# EAGLE schematic Jetsonboardbackup (EAGLE 9.4.2)
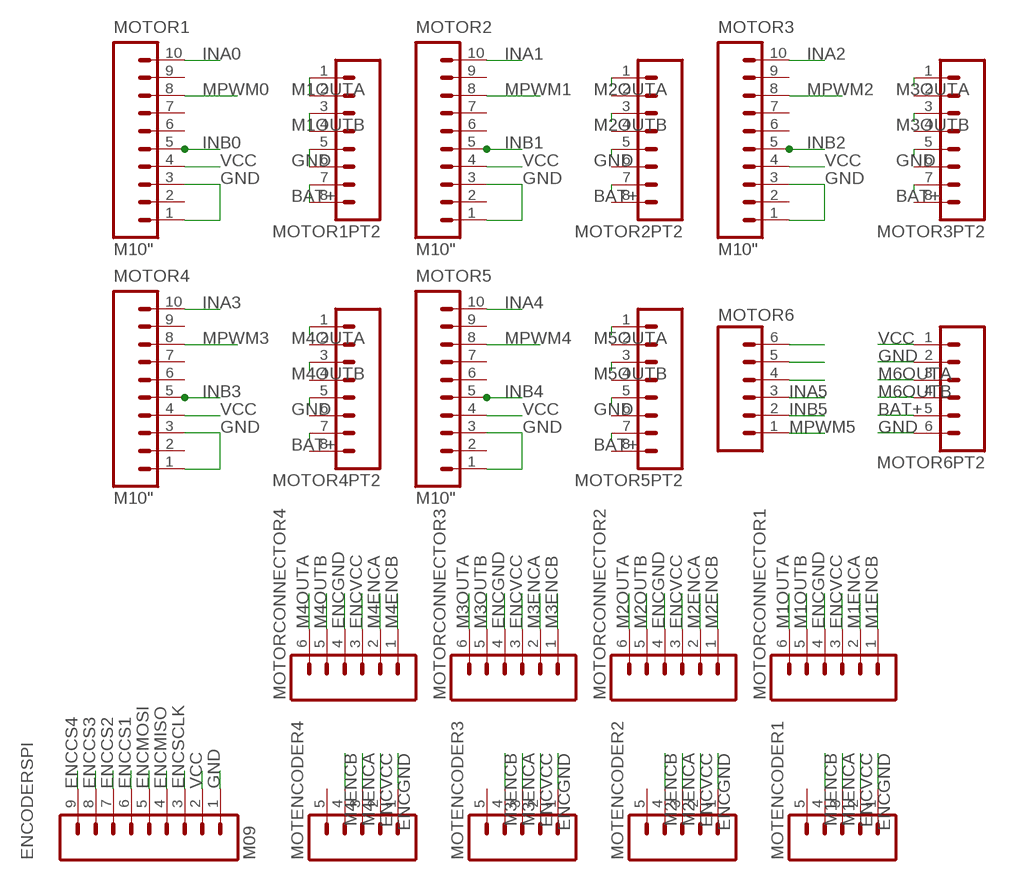
[diagram p0: schematic, sheet 1, part 1 of 2]
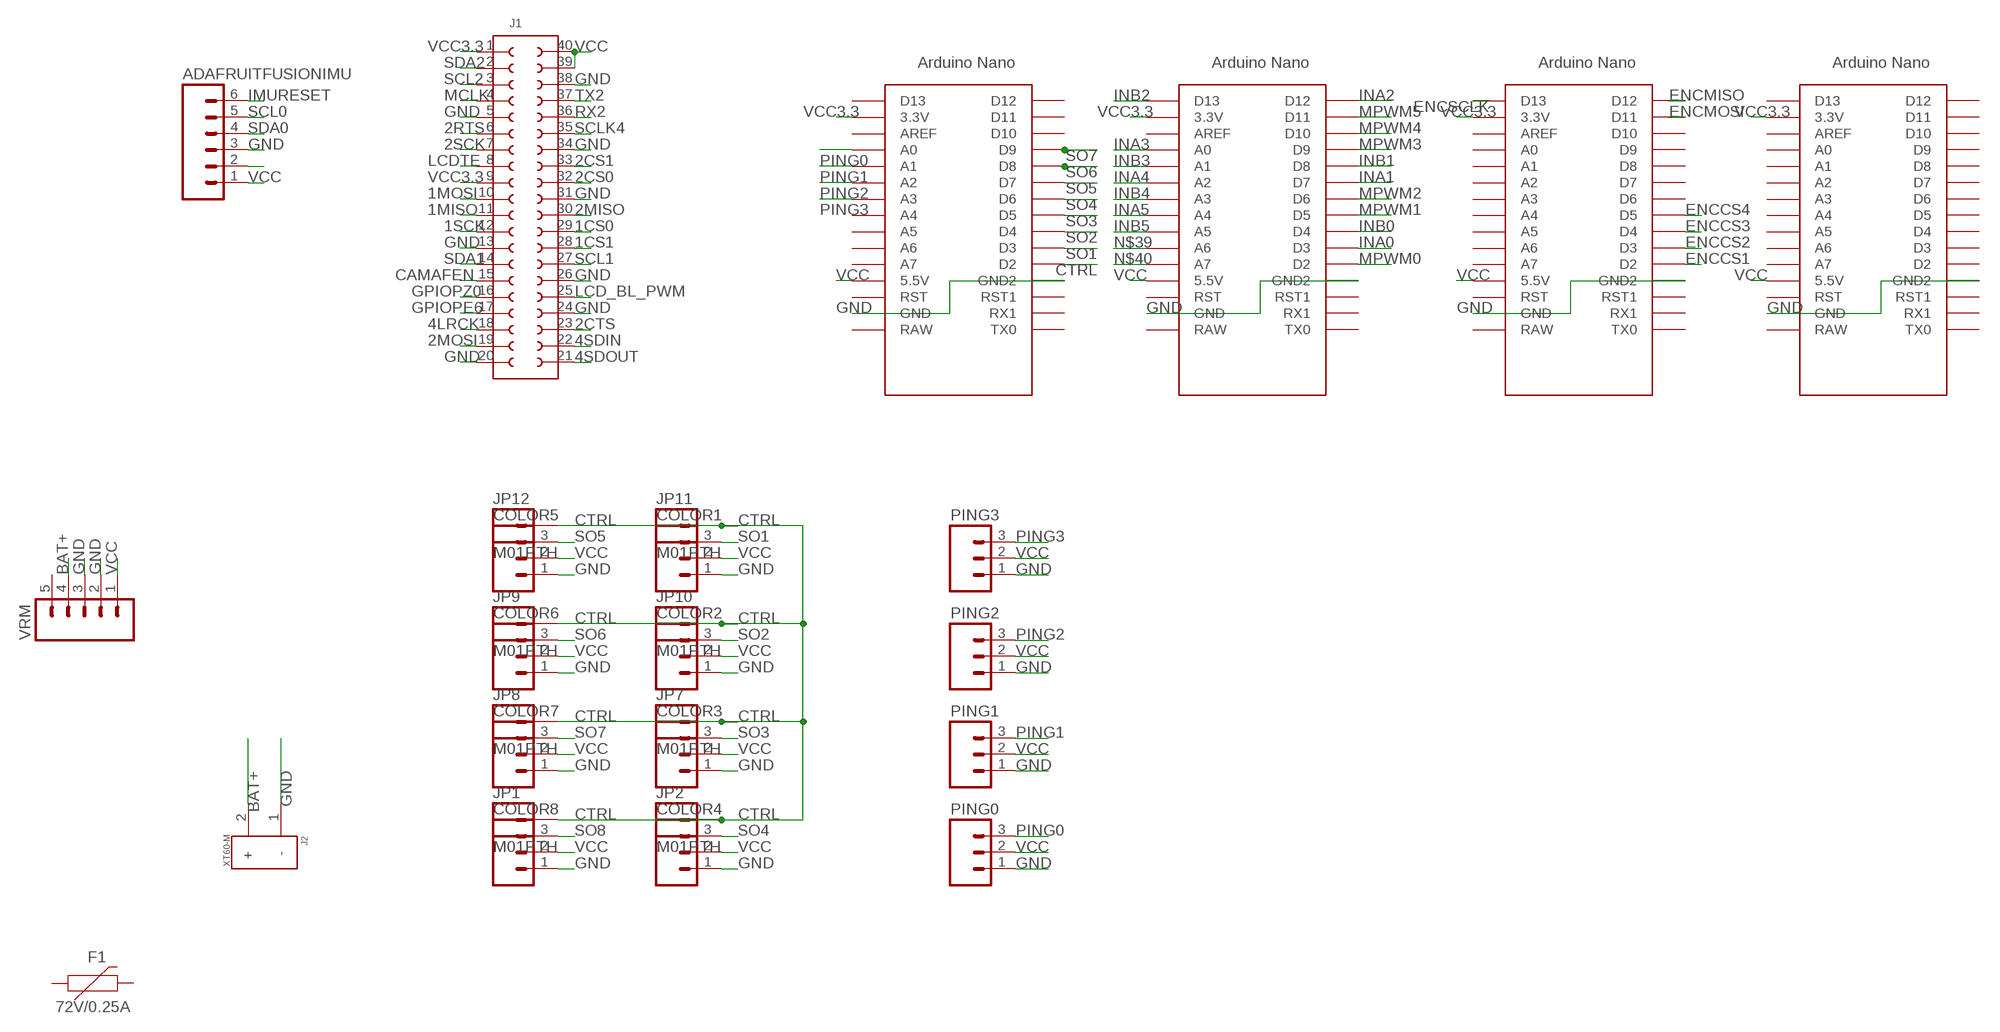
[diagram p1: schematic, sheet 1, part 2 of 2]

## Parts
ADAFRUITFUSIONIMU  M06SIP  [1X06]
COLOR1  M03PTH  [1X03]
COLOR2  M03PTH  [1X03]
COLOR3  M03PTH  [1X03]
COLOR4  M03PTH  [1X03]
COLOR5  M03PTH  [1X03]
COLOR6  M03PTH  [1X03]
COLOR7  M03PTH  [1X03]
COLOR8  M03PTH  [1X03]
ENCODERSPI  M09  [1X09]
F1  72V/0.25A  PPTC_PTH  [PTH]
J1  61304021021  [61304021021]
J2  XT60-M  [AMASS_XT60-M]
JP1  M01PTH  [1X01]
JP2  M01PTH  [1X01]
JP7  M01PTH  [1X01]
JP8  M01PTH  [1X01]
JP9  M01PTH  [1X01]
JP10  M01PTH  [1X01]
JP11  M01PTH  [1X01]
JP12  M01PTH  [1X01]
MOTENCODER1  M05PTH  [1X05]
MOTENCODER2  M05PTH  [1X05]
MOTENCODER3  M05PTH  [1X05]
MOTENCODER4  M05PTH  [1X05]
MOTOR1  M10"  [1X10]
MOTOR1PT2  M08  [1X08]
MOTOR2  M10"  [1X10]
MOTOR2PT2  M08  [1X08]
MOTOR3  M10"  [1X10]
MOTOR3PT2  M08  [1X08]
MOTOR4  M10"  [1X10]
MOTOR4PT2  M08  [1X08]
MOTOR5  M10"  [1X10]
MOTOR5PT2  M08  [1X08]
MOTOR6  M06SIP  [1X06]
MOTOR6PT2  M06SIP  [1X06]
MOTORCONNECTOR1  M06LONGPADS  [1X06_LONGPADS]
MOTORCONNECTOR2  M06LONGPADS  [1X06_LONGPADS]
MOTORCONNECTOR3  M06LONGPADS  [1X06_LONGPADS]
MOTORCONNECTOR4  M06LONGPADS  [1X06_LONGPADS]
PING0  M03PTH  [1X03]
PING1  M03PTH  [1X03]
PING2  M03PTH  [1X03]
PING3  M03PTH  [1X03]
U$1  NANO  [NANO]
U$2  NANO  [NANO]
U$3  NANO  [NANO]
U$6  NANO  [NANO]
VRM  M05PTH  [1X05]

## Nets
1CS0: J1.29
1CS1: J1.28
1MISO: J1.11
1MOSI: J1.10
1SCK: J1.12
2CS0: J1.32
2CS1: J1.33
2CTS: J1.23
2MISO: J1.30
2MOSI: J1.19
2RTS: J1.6
2SCK: J1.7
4LRCK: J1.18
4SDIN: J1.22
4SDOUT: J1.21
BAT+: J2.2(+) MOTOR1PT2.7 MOTOR1PT2.8 MOTOR2PT2.8 MOTOR3PT2.8 MOTOR4PT2.8 MOTOR5PT2.8 MOTOR6PT2.5 VRM.4
CAMAFEN: J1.15
CTRL: JP1.1 JP2.1 JP7.1 JP8.1 JP9.1 JP10.1 JP11.1 JP12.1 U$2.D2
ENCCS1: ENCODERSPI.6 U$1.D2
ENCCS2: ENCODERSPI.7 U$1.D3
ENCCS3: ENCODERSPI.8 U$1.D4
ENCCS4: ENCODERSPI.9 U$1.D5
ENCGND: MOTENCODER1.1 MOTENCODER2.1 MOTENCODER3.1 MOTENCODER4.1 MOTORCONNECTOR1.4 MOTORCONNECTOR2.4 MOTORCONNECTOR3.4 MOTORCONNECTOR4.4
ENCMISO: ENCODERSPI.4 U$1.D12
ENCMOSI: ENCODERSPI.5 U$1.D11
ENCSCLK: ENCODERSPI.3 U$1.D13
ENCVCC: MOTENCODER1.2 MOTENCODER2.2 MOTENCODER3.2 MOTENCODER4.2 MOTORCONNECTOR1.3 MOTORCONNECTOR2.3 MOTORCONNECTOR3.3 MOTORCONNECTOR4.3
GND: ADAFRUITFUSIONIMU.3 COLOR1.1 COLOR2.1 COLOR3.1 COLOR4.1 COLOR5.1 COLOR6.1 COLOR7.1 COLOR8.1 ENCODERSPI.1 J1.5 J1.13 J1.20 J1.24 J1.26 J1.31 J1.34 J1.38 J2.1(-) MOTOR1.1 MOTOR1.3 MOTOR1PT2.5 MOTOR1PT2.6 MOTOR2.1 MOTOR2.3 MOTOR2PT2.6 MOTOR3.1 MOTOR3.3 MOTOR3PT2.6 MOTOR4.1 MOTOR4.3 MOTOR4PT2.6 MOTOR5.1 MOTOR5.3 MOTOR5PT2.6 MOTOR6PT2.2 MOTOR6PT2.6 PING0.1 PING1.1 PING2.1 PING3.1 U$1.GND U$1.GND1(GND2) U$2.GND U$2.GND1(GND2) U$3.GND U$3.GND1(GND2) U$6.GND U$6.GND1(GND2) VRM.2 VRM.3
GPIOPE6: J1.17
GPIOPZ0: J1.16
IMURESET: ADAFRUITFUSIONIMU.6
INA0: MOTOR1.10 U$6.D3
INA1: MOTOR2.10 U$6.D7
INA2: MOTOR3.10 U$6.D12
INA3: MOTOR4.10 U$6.A0
INA4: MOTOR5.10 U$6.A2
INA5: MOTOR6.3 U$6.A4
INB0: MOTOR1.5 U$6.D4
INB1: MOTOR2.5 U$6.D8
INB2: MOTOR3.5 U$6.D13
INB3: MOTOR4.5 U$6.A1
INB4: MOTOR5.5 U$6.A3
INB5: MOTOR6.2 U$6.A5
LCD_BL_PWM: J1.25
LCDTE: J1.8
M1ENCA: MOTENCODER1.3 MOTORCONNECTOR1.2
M1ENCB: MOTENCODER1.4 MOTORCONNECTOR1.1
M1OUTA: MOTOR1PT2.1 MOTOR1PT2.2 MOTORCONNECTOR1.6
M1OUTB: MOTOR1PT2.3 MOTOR1PT2.4 MOTORCONNECTOR1.5
M2ENCA: MOTENCODER2.3 MOTORCONNECTOR2.2
M2ENCB: MOTENCODER2.4 MOTORCONNECTOR2.1
M2OUTA: MOTOR2PT2.2 MOTORCONNECTOR2.6
M2OUTB: MOTOR2PT2.4 MOTORCONNECTOR2.5
M3ENCA: MOTENCODER3.3 MOTORCONNECTOR3.2
M3ENCB: MOTENCODER3.4 MOTORCONNECTOR3.1
M3OUTA: MOTOR3PT2.2 MOTORCONNECTOR3.6
M3OUTB: MOTOR3PT2.4 MOTORCONNECTOR3.5
M4ENCA: MOTENCODER4.3 MOTORCONNECTOR4.2
M4ENCB: MOTENCODER4.4 MOTORCONNECTOR4.1
M4OUTA: MOTOR4PT2.2 MOTORCONNECTOR4.6
M4OUTB: MOTOR4PT2.4 MOTORCONNECTOR4.5
M5OUTA: MOTOR5PT2.2
M5OUTB: MOTOR5PT2.4
M6OUTA: MOTOR6PT2.3
M6OUTB: MOTOR6PT2.4
MCLK: J1.4
MPWM0: MOTOR1.8 U$6.D2
MPWM1: MOTOR2.8 U$6.D5
MPWM2: MOTOR3.8 U$6.D6
MPWM3: MOTOR4.8 U$6.D9
MPWM4: MOTOR5.8 U$6.D10
MPWM5: MOTOR6.1 U$6.D11
N$1: MOTOR2PT2.5
N$2: MOTOR2PT2.7
N$3: MOTOR2PT2.1
N$4: MOTOR6.4
N$5: MOTOR6.5
N$6: MOTOR6.6
N$7: MOTOR2PT2.3
N$8: ADAFRUITFUSIONIMU.2
N$9: MOTOR3PT2.5
N$10: MOTOR3PT2.7
N$11: MOTOR3PT2.1
N$12: MOTOR3PT2.3
N$13: MOTOR4PT2.5
N$14: MOTOR4PT2.7
N$15: MOTOR4PT2.1
N$16: MOTOR4PT2.3
N$17: MOTOR5PT2.5
N$18: MOTOR5PT2.7
N$19: MOTOR5PT2.1
N$20: MOTOR5PT2.3
N$39: U$6.A6
N$40: U$6.A7
PING0: PING0.3 U$2.A0
PING1: PING1.3 U$2.A1
PING2: PING2.3 U$2.A2
PING3: PING3.3 U$2.A3
RX2: J1.36
SCL0: ADAFRUITFUSIONIMU.5
SCL1: J1.27
SCL2: J1.3
SCLK4: J1.35
SDA0: ADAFRUITFUSIONIMU.4
SDA1: J1.14
SDA2: J1.2
SO1: COLOR1.3 U$2.D3
SO2: COLOR2.3 U$2.D4
SO3: COLOR3.3 U$2.D5
SO4: COLOR4.3 U$2.D6
SO5: COLOR5.3 U$2.D7
SO6: COLOR6.3 U$2.D8
SO7: COLOR7.3 U$2.D9
SO8: COLOR8.3
TX2: J1.37
VCC: ADAFRUITFUSIONIMU.1 COLOR1.2 COLOR2.2 COLOR3.2 COLOR4.2 COLOR5.2 COLOR6.2 COLOR7.2 COLOR8.2 ENCODERSPI.2 J1.39 J1.40 MOTOR1.4 MOTOR2.4 MOTOR3.4 MOTOR4.4 MOTOR5.4 MOTOR6PT2.1 PING0.2 PING1.2 PING2.2 PING3.2 U$1.5V(5.5V) U$2.5V(5.5V) U$3.5V(5.5V) U$6.5V(5.5V) VRM.1
VCC3.3: J1.1 J1.9 U$1.3.3V U$2.3.3V U$3.3.3V U$6.3.3V
Unconnected: F1.P$1 F1.P$2 MOTENCODER1.5 MOTENCODER2.5 MOTENCODER3.5 MOTENCODER4.5 MOTOR1.2 MOTOR1.6 MOTOR1.7 MOTOR1.9 MOTOR2.2 MOTOR2.6 MOTOR2.7 MOTOR2.9 MOTOR3.2 MOTOR3.6 MOTOR3.7 MOTOR3.9 MOTOR4.2 MOTOR4.6 MOTOR4.7 MOTOR4.9 MOTOR5.2 MOTOR5.6 MOTOR5.7 MOTOR5.9 U$1.A0 U$1.A1 U$1.A2 U$1.A3 U$1.A4 U$1.A5 U$1.A6 U$1.A7 U$1.AREF U$1.D6 U$1.D7 U$1.D8 U$1.D9 U$1.D10 U$1.ICSP1 U$1.ICSP2 U$1.ICSP3 U$1.ICSP4 U$1.ICSP5 U$1.ICSP6 U$1.RAW U$1.RST U$1.RST1 U$1.RX1 U$1.TX0 U$2.A4 U$2.A5 U$2.A6 U$2.A7 U$2.AREF U$2.D10 U$2.D11 U$2.D12 U$2.D13 U$2.ICSP1 U$2.ICSP2 U$2.ICSP3 U$2.ICSP4 U$2.ICSP5 U$2.ICSP6 U$2.RAW U$2.RST U$2.RST1 U$2.RX1 U$2.TX0 U$3.A0 U$3.A1 U$3.A2 U$3.A3 U$3.A4 U$3.A5 U$3.A6 U$3.A7 U$3.AREF U$3.D2 U$3.D3 U$3.D4 U$3.D5 U$3.D6 U$3.D7 U$3.D8 U$3.D9 U$3.D10 U$3.D11 U$3.D12 U$3.D13 U$3.ICSP1 U$3.ICSP2 U$3.ICSP3 U$3.ICSP4 U$3.ICSP5 U$3.ICSP6 U$3.RAW U$3.RST U$3.RST1 U$3.RX1 U$3.TX0 U$6.AREF U$6.ICSP1 U$6.ICSP2 U$6.ICSP3 U$6.ICSP4 U$6.ICSP5 U$6.ICSP6 U$6.RAW U$6.RST U$6.RST1 U$6.RX1 U$6.TX0 VRM.5

## Library data of the parts
ADAFRUITFUSIONIMU MOTOR6 MOTOR6PT2 MOTORCONNECTOR1-MOTORCONNECTOR4 = SparkFun:M06: Header 6 Standard 6-pin 0.1" header. Use with straight break away headers (SKU : PRT-00116), right angle break away headers (PRT-00553), swiss pins (PRT-00743), machine pins (PRT-00117), and female headers (PRT-00115). Molex polarized connector foot print use with SKU : PRT-08094 with associated crimp pins and housings. NOTES ON THE VARIANTS LOCK and LOCK_LONGPADS... This footprint was designed to help hold the alignment of a through-hole component (i.e. 6-pin header) while soldering it into place. You may notice that each hole has been shifted either up or down by 0.005 of an inch from it's more standard position (which is a perfectly straight line). This slight alteration caused the pins (the squares in the middle) to touch the edges of the holes. Because they are alternating, it causes a "brace" to hold the component in place. 0.005 has proven to be the perfect amount of "off-center" position when using our standard breakaway headers. Although looks a little odd when you look at the bare footprint, once you have a header in there, the alteration is very hard to notice. Also, if you push a header all the way into place, it is covered up entirely on the bottom side. This idea of altering the position of holes to aid alignment will be further integrated into the Sparkfun Library for other footprints. It can help hold any component with 3 or more connection pins.
COLOR1-COLOR8 PING0 PING1-PING3 = SparkFun:M03: Header 3 Standard 3-pin 0.1" header. Use with straight break away headers (SKU : PRT-00116), right angle break away headers (PRT-00553), swiss pins (PRT-00743), machine pins (PRT-00117), and female headers (PRT-00115). Molex polarized connector foot print use with SKU : PRT-08232 with associated crimp pins and housings.
ENCODERSPI = SparkFun:M09: Header 9 Standard 9-pin 0.1" header. Use with straight break away headers (SKU : PRT-00116), right angle break away headers (PRT-00553), swiss pins (PRT-00743), machine pins (PRT-00117), and female headers (PRT-00115).
F1 = SparkFun-Fuses:PPTC: Resettable Fuse PPTC Resettable Fuse. Really a sort of resistor with a polymeric positive temperature coefficient whose resistance increases dramatically with an increase in temperature. When heated by the power passing through the resistance rises causing the current to be limited, protecting the circuit. This is achieved by the transition of the polymer from a crystalline to an amorphous state where the conductive carbon separates breaking the conductive pathways found in the cool crystalline structure. When a PPTC cools back down it resumes conducting letting the circuit turn back on. SparkFun Products: SparkFun RedBoard - Programmed with Arduino <https://www.sparkfun.com/products/12757> Pro Micro - 5V/16MHz <https://www.sparkfun.com/products/12640> Arduino Pro 328 - 5V/16MHz <https://www.sparkfun.com/products/10915> MP3 Trigger <https://www.sparkfun.com/products/13720>; PROD_ID: RES-08490
J1 = Wurth_Elektronik_Electromechanic_Board_to_Board_Connectors_rev17a:61304021021: WR-PHD 2.54mm Angled Dual Pin Header, 40 Pins =>Code : Con_BTB_PHD_2.54_2_61304021021 <http://katalog.we-online.de/media/images/v2/Family_wr-phd_6130XX21021.jpg> Details see: http://katalog.we-online.de/en/em/613_0xx_210_21 Created 2014-05-29, Karrer Zheng 2014 (C) Würth Elektronik
J2 = XT60-M:XT60-M: DC supply; XT60; male; PIN:2; for cable; soldered; 60A; 500V; AVAILABILITY: Unavailable; MF: AMASS; MP: XT60-M; PACKAGE: Package Analog Devices; PRICE: None
JP1 JP2 JP7-JP12 = SparkFun:M01: Header 1 Standard 1-pin 0.1" header. Use with straight break away headers (SKU : PRT-00116), right angle break away headers (PRT-00553), swiss pins (PRT-00743), machine pins (PRT-00117), and female headers (PRT-00115).
MOTENCODER1-MOTENCODER4 VRM = SparkFun:M05: Header 5 Standard 5-pin 0.1" header. Use with straight break away headers (SKU : PRT-00116), right angle break away headers (PRT-00553), swiss pins (PRT-00743), machine pins (PRT-00117), and female headers (PRT-00115). Molex polarized connector foot print use with SKU : PRT-08230 with associated crimp pins and housings.
MOTOR1-MOTOR5 = SparkFun:M10: Header 10 Standard 10-pin 0.1" header. Use with straight break away headers (SKU : PRT-00116), right angle break away headers (PRT-00553), swiss pins (PRT-00743), machine pins (PRT-00117), and female headers (PRT-00115).
MOTOR1PT2 MOTOR2PT2 MOTOR3PT2 MOTOR4PT2 MOTOR5PT2 = SparkFun:M08: Header 8 Standard 8-pin 0.1" header. Use with straight break away headers (SKU : PRT-00116), right angle break away headers (PRT-00553), swiss pins (PRT-00743), machine pins (PRT-00117), and female headers (PRT-00115).
U$1-U$3 U$6 = Arduino-clone:NANO: Arduino Nano